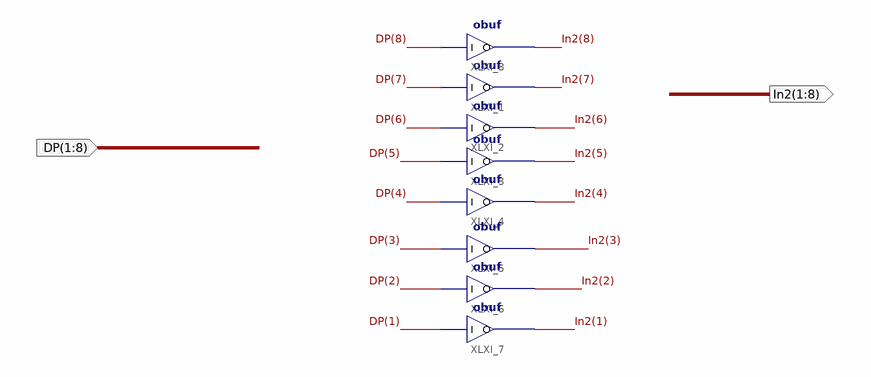
[diagram p0: schematic sheet 1]
// Xilinx ISE schematic input2.sch (spartan6) as structural Verilog: 8 symbols, 2 ports
module input2 (
  input  [1:8] DP,
  output [1:8] In2
);

  obuf XLXI_1 (.I(DP[7]), .O(In2[7]));
  obuf XLXI_2 (.I(DP[6]), .O(In2[6]));
  obuf XLXI_3 (.I(DP[5]), .O(In2[5]));
  obuf XLXI_4 (.I(DP[4]), .O(In2[4]));
  obuf XLXI_5 (.I(DP[3]), .O(In2[3]));
  obuf XLXI_6 (.I(DP[2]), .O(In2[2]));
  obuf XLXI_7 (.I(DP[1]), .O(In2[1]));
  obuf XLXI_8 (.I(DP[8]), .O(In2[8]));
endmodule
